# EAGLE board R211 (EAGLE 6.6.0)
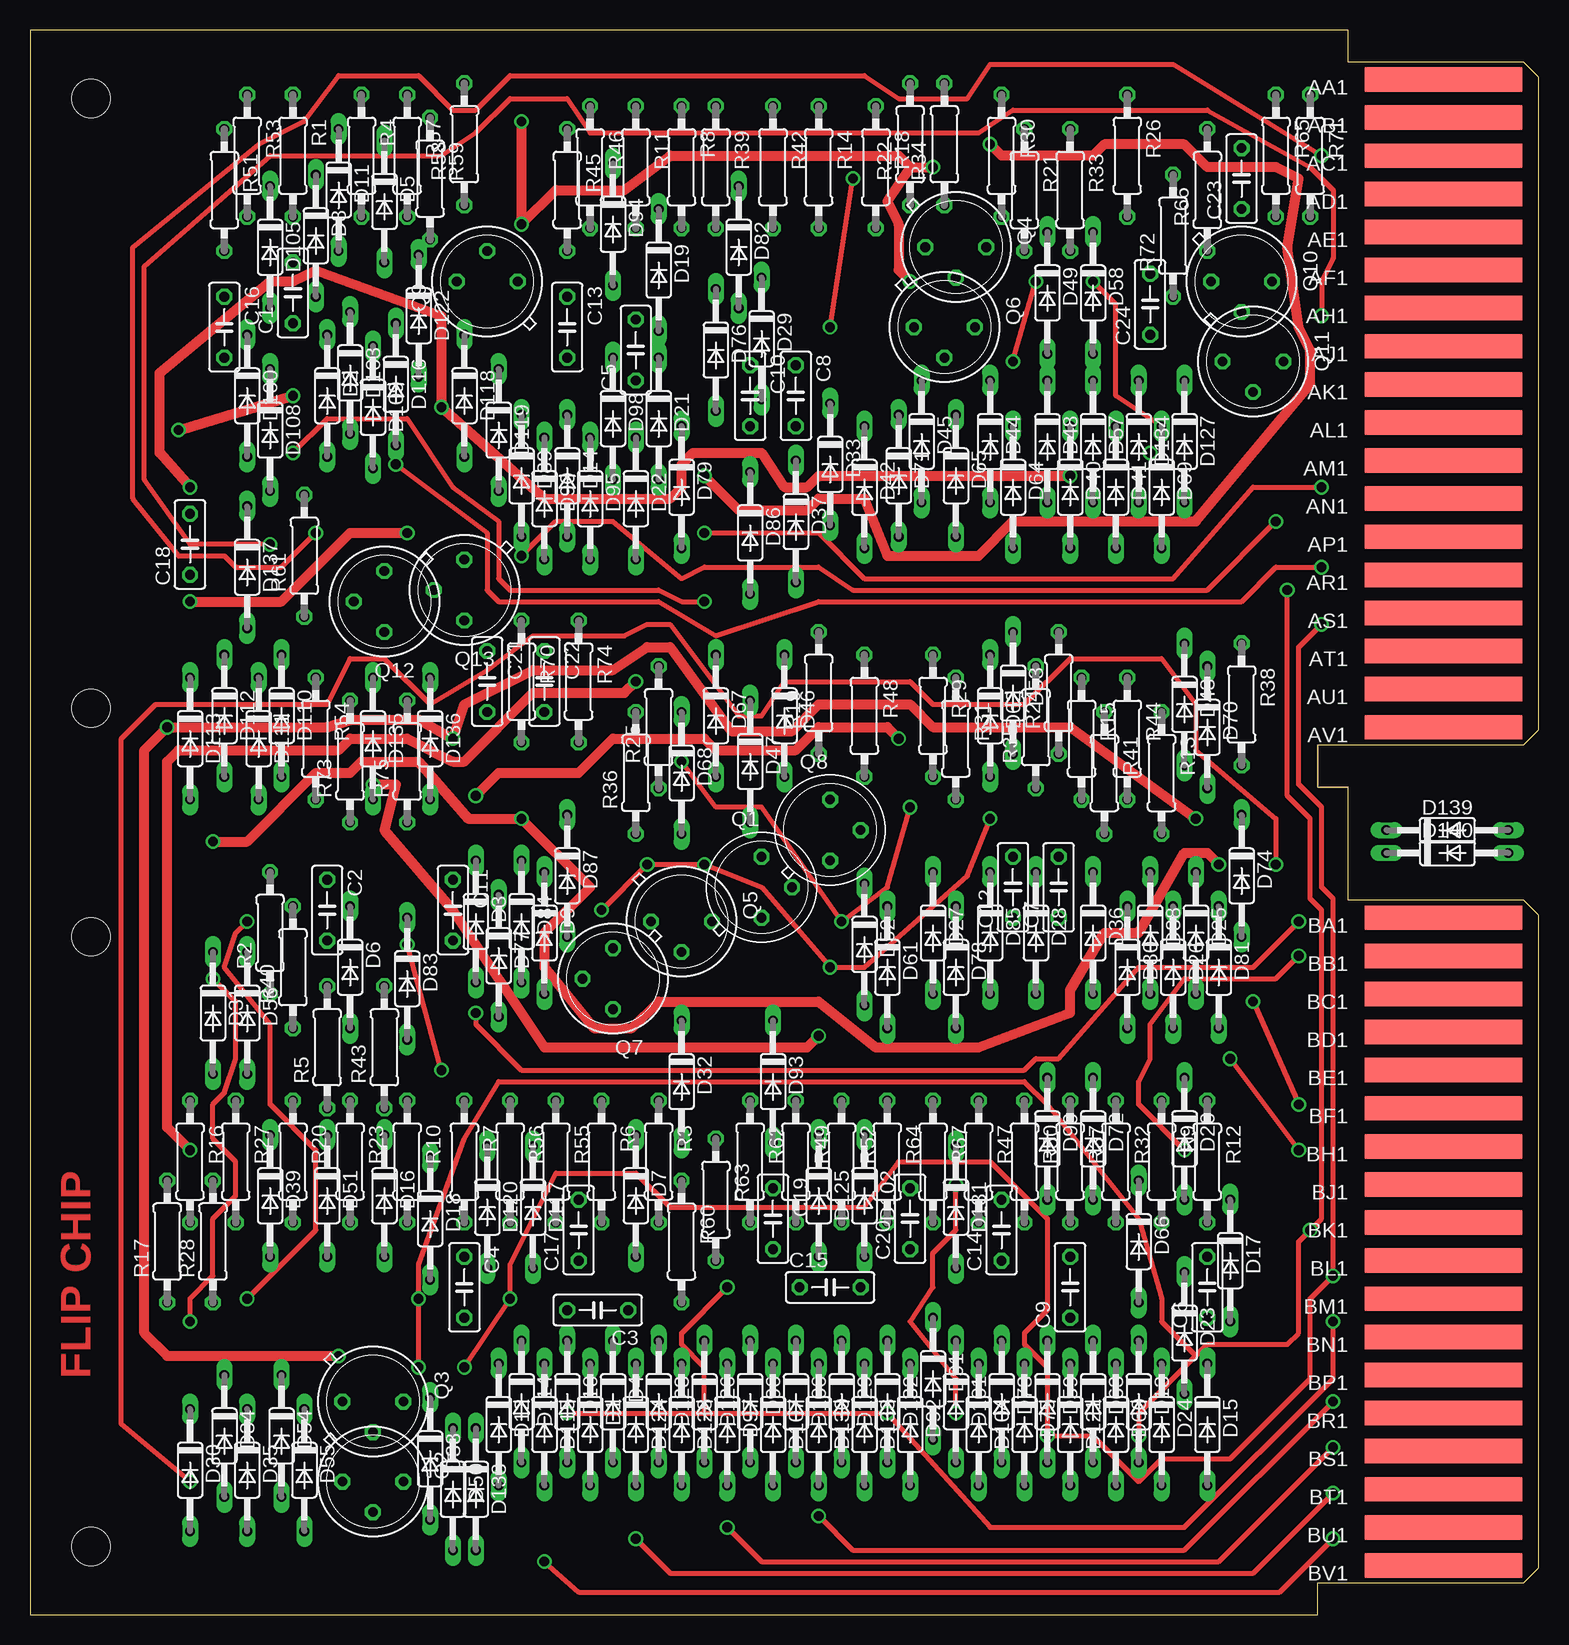
[diagram p1: board, top side]
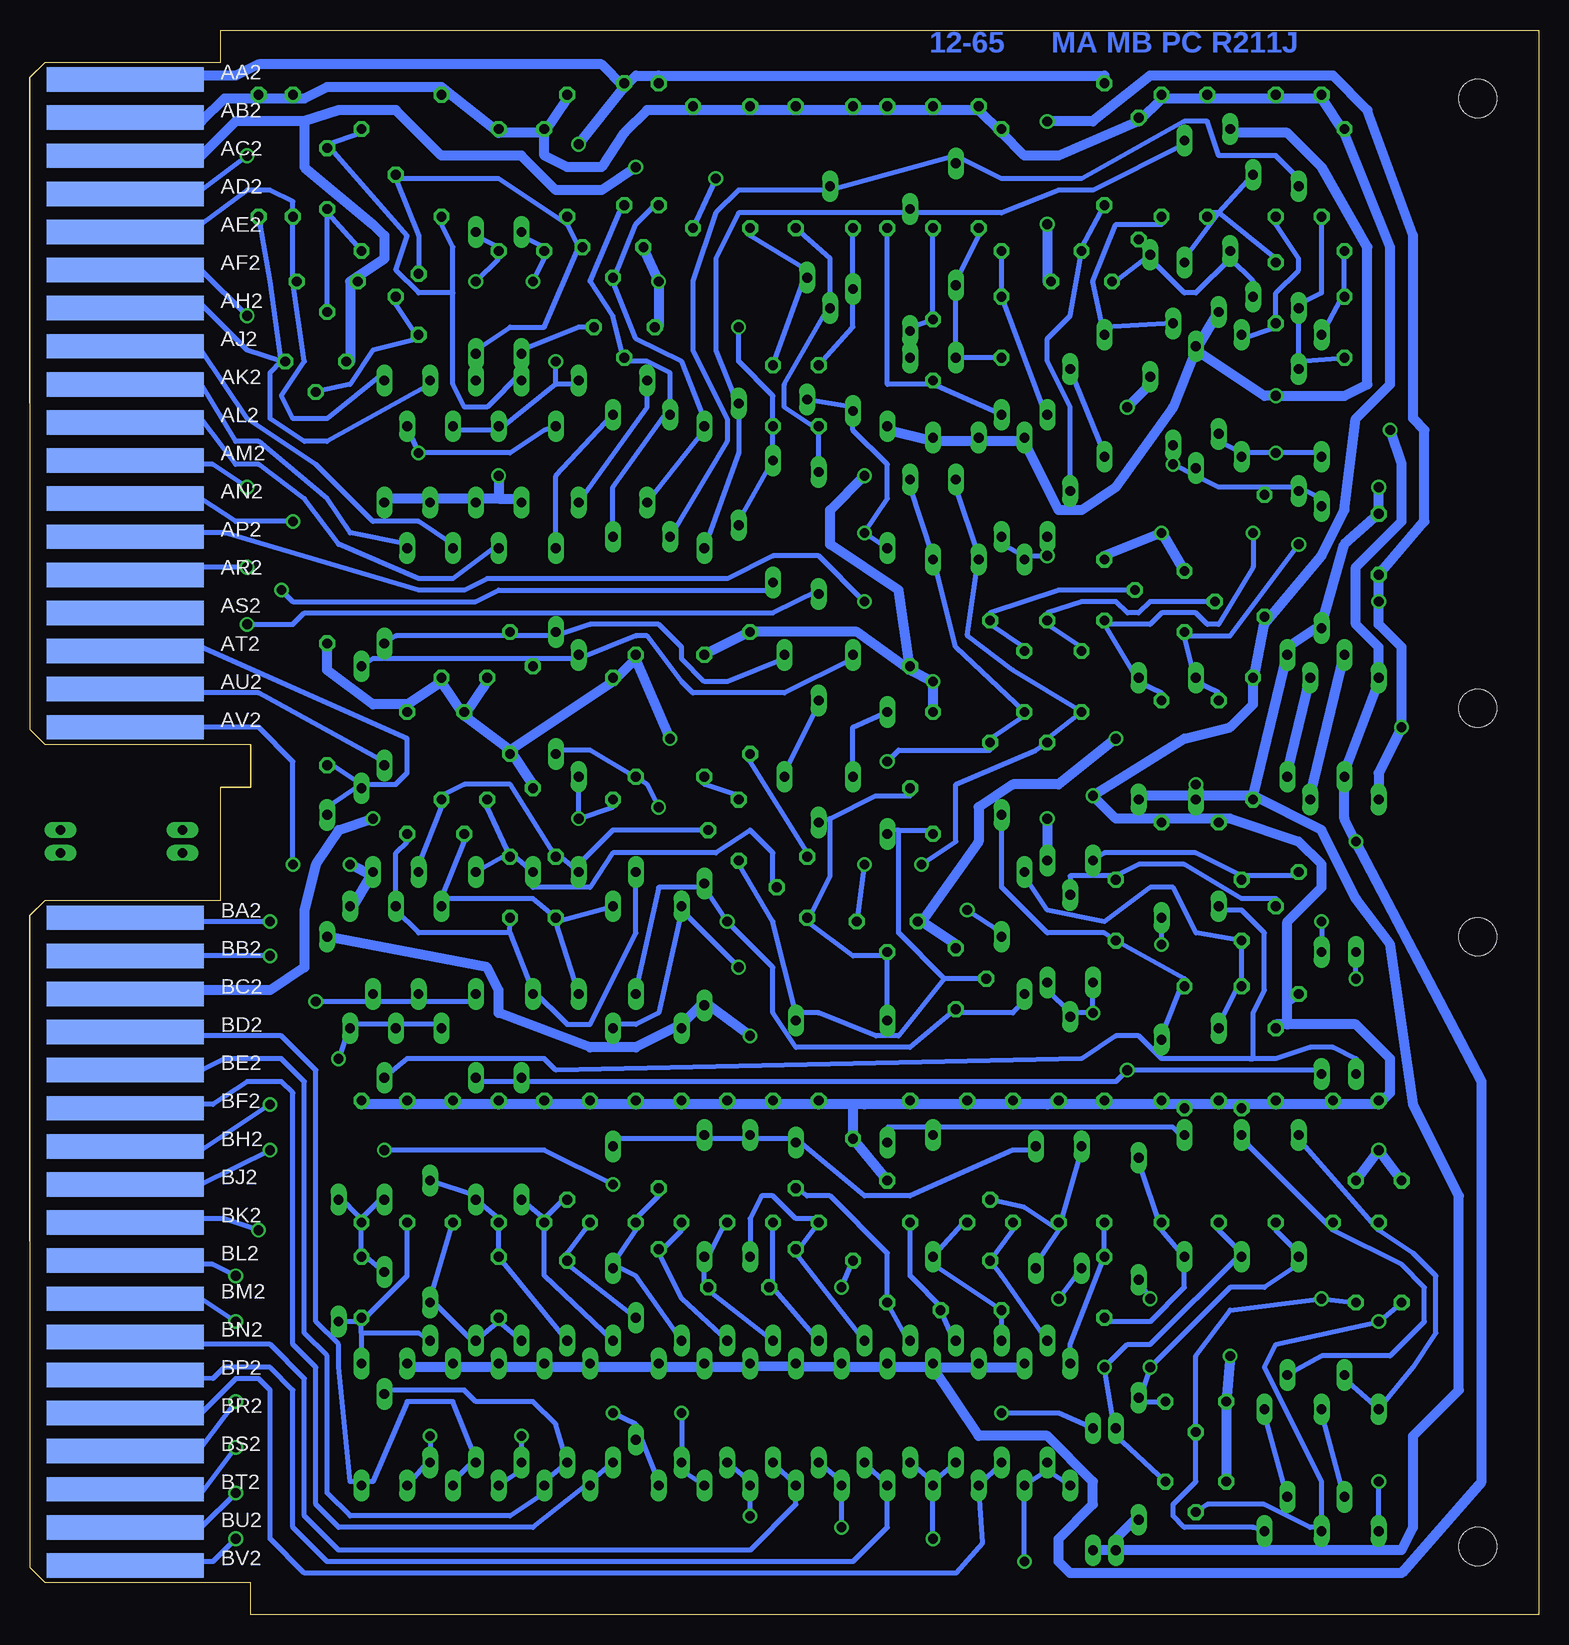
[diagram p2: board, bottom side, seen from below]

Size 125.73 x 132.08 mm. Coordinates in mm from the lower left corner, seen from the top.
Copper layers (1+16): Top 0.035mm / dielectric 1.5mm / Bottom 0.035mm
Design rules "16mils": minimum track width 16mil, minimum drill 32mil, track to track 15mil, track to pad 10mil, pad to pad 10mil, via to via 10mil, smd to smd 10mil, copper to edge 13mil, drill to drill 10mil, minimum pad ring 10mil, minimum via ring 8mil, stop-mask expansion 0mil, vias tented up to drill 0mil, thermal gap 10mil
Net classes: 1 Power: width 0.813 mm

## Footprints (pad centres in the part's own frame; a part is rotated, then mirrored left to right if it is on the bottom)
C050-025X075 = drill 0.813 octagon: 1 -2.54,0; 2 2.54,0
DO35-10 = drill 0.813 long: A 5.08,0; C -5.08,0
TO5 = drill 0.813 octagon: 1 0,-2.54; 2 2.54,0; 3 0,2.54
TO39 = drill 0.813 octagon: 1 0,-2.54; 2 2.54,0; 3 0,2.54
0207/10 = drill 0.813 octagon: 1 -5.08,0; 2 5.08,0
EDGE-CON4 = smd 13.106 x 2.032: AA1 7.938,4.128; AB1 7.938,7.303; AC1 7.938,10.477; AD1 7.938,13.652; AE1 7.938,16.828; AF1 7.938,20.003; AH1 7.938,23.177; AJ1 7.938,26.352; AK1 7.938,29.527; AL1 7.938,32.703; AM1 7.938,35.877; AN1 7.938,39.053; AP1 7.938,42.227; AR1 7.938,45.403; AS1 7.938,48.578; AT1 7.938,51.752; AU1 7.938,54.928; AV1 7.938,58.102; BA1 7.938,73.978; BB1 7.938,77.153; BC1 7.938,80.328; BD1 7.938,83.502; BE1 7.938,86.677; BF1 7.938,89.853; BH1 7.938,93.028; BJ1 7.938,96.203; BK1 7.938,99.377; BL1 7.938,102.552; BM1 7.938,105.728; BN1 7.938,108.903; BP1 7.938,112.078; BR1 7.938,115.252; BS1 7.938,118.427; BT1 7.938,121.603; BU1 7.938,124.778; BV1 7.938,127.953 | smd 13.106 x 2.032 bottom: AA2 7.938,4.128; AB2 7.938,7.303; AC2 7.938,10.477; AD2 7.938,13.652; AE2 7.938,16.828; AF2 7.938,20.003; AH2 7.938,23.177; AJ2 7.938,26.352; AK2 7.938,29.527; AL2 7.938,32.703; AM2 7.938,35.877; AN2 7.938,39.053; AP2 7.938,42.227; AR2 7.938,45.403; AS2 7.938,48.578; AT2 7.938,51.752; AU2 7.938,54.928; AV2 7.938,58.102; BA2 7.938,73.978; BB2 7.938,77.153; BC2 7.938,80.328; BD2 7.938,83.502; BE2 7.938,86.677; BF2 7.938,89.853; BH2 7.938,93.028; BJ2 7.938,96.203; BK2 7.938,99.377; BL2 7.938,102.552; BM2 7.938,105.728; BN2 7.938,108.903; BP2 7.938,112.078; BR2 7.938,115.252; BS2 7.938,118.427; BT2 7.938,121.603; BU2 7.938,124.778; BV2 7.938,127.953
DOUBLE = hole 3.175: 120.65,56.515; 120.65,5.715; 120.65,75.565; 120.65,126.365

## Placement (x,y rotation side)
C1  82pF 5%  [C050-025X075]  21.91,110.17 90 top
C2  82pF 5%  [C050-025X075]  24.77,58.74 270 top
C3  82pF 5%  [C050-025X075]  47.31,25.4 180 top
C4  82pF 5%  [C050-025X075]  36.2,27.31 270 top
C5  82pF 5%  [C050-025X075]  50.48,105.41 90 top
C6  82pF 5%  [C050-025X075]  98.11,27.31 90 top
C7  47pF 5%  [C050-025X075]  85.72,60.64 90 top
C8  82pF 5%  [C050-025X075]  63.82,101.6 270 top
C9  82pF 5%  [C050-025X075]  86.68,27.31 90 top
C10  82pF 5%  [C050-025X075]  60.01,101.6 270 top
C11  82pF 5%  [C050-025X075]  35.24,58.74 270 top
C12  47pF 5%  [C050-025X075]  81.92,60.64 90 top
C13  82pF 5%  [C050-025X075]  44.77,107.32 270 top
C14  82pF 5%  [C050-025X075]  80.96,32.07 90 top
C15  82pF 5%  [C050-025X075]  66.67,27.31 0 top
C16  82pF 5%  [C050-025X075]  16.19,107.32 270 top
C17  82pF 5%  [C050-025X075]  45.72,32.07 90 top
C18  .01uF  [C050-025X075]  13.34,89.22 90 top
C19  82pF 5%  [C050-025X075]  61.91,33.02 270 top
C20  82pF 5%  [C050-025X075]  73.34,33.02 90 top
C21  56pF  [C050-025X075]  38.1,77.79 270 top
C22  56pF  [C050-025X075]  42.86,77.79 270 top
C23  56pF  [C050-025X075]  100.97,119.7 90 top
C24  56pF  [C050-025X075]  93.34,109.22 90 top
D1  [DO35-10]  46.67,15.88 270 top
D2  [DO35-10]  24.77,101.6 270 top
D3  [DO35-10]  37.15,57.79 270 top
D4  [DO35-10]  48.58,17.78 270 top
D5  [DO35-10]  29.53,117.79 270 top
D6  [DO35-10]  26.67,53.98 270 top
D7  [DO35-10]  50.48,34.93 270 top
D8  [DO35-10]  23.81,114.94 270 top
D9  [DO35-10]  42.86,56.83 270 top
D10  [DO35-10]  44.77,17.78 270 top
D11  [DO35-10]  25.72,118.75 270 top
D12  [DO35-10]  39.05,15.88 270 top
D13  [DO35-10]  92.39,17.78 270 top
D14  [DO35-10]  44.77,94.93 270 top
D15  [DO35-10]  98.11,15.88 270 top
D16  [DO35-10]  29.53,34.93 270 top
D17  [DO35-10]  100.01,29.53 270 top
D18  [DO35-10]  33.34,33.02 270 top
D19  [DO35-10]  52.39,112.08 270 top
D20  [DO35-10]  96.2,39.69 270 top
D21  [DO35-10]  52.39,99.7 270 top
D22  [DO35-10]  50.48,93.03 270 top
D23  [DO35-10]  96.2,23.5 270 top
D24  [DO35-10]  94.3,15.88 270 top
D25  [DO35-10]  97.16,56.83 270 top
D26  [DO35-10]  95.25,53.98 270 top
D27  [DO35-10]  75.25,56.83 270 top
D28  [DO35-10]  83.82,56.83 270 top
D29  [DO35-10]  60.96,106.36 270 top
D30  [DO35-10]  13.34,12.07 270 top
D31  [DO35-10]  15.24,50.17 270 top
D32  [DO35-10]  54.29,44.45 270 top
D33  [DO35-10]  66.67,95.89 270 top
D34  1N645  [DO35-10]  16.19,14.92 270 top
D35  1N645  [DO35-10]  18.1,12.07 270 top
D36  [DO35-10]  88.58,56.83 270 top
D37  [DO35-10]  63.82,91.12 270 top
D38  [DO35-10]  33.34,13.02 270 top
D39  [DO35-10]  20,34.93 270 top
D40  [DO35-10]  86.68,93.98 270 top
D41  [DO35-10]  90.49,93.98 270 top
D42  [DO35-10]  69.53,93.98 270 top
D43  [DO35-10]  96.2,75.88 270 top
D44  1N645  [DO35-10]  80.01,97.79 270 top
D45  1N645  [DO35-10]  74.3,97.79 270 top
D46  1N645  [DO35-10]  62.87,74.93 270 top
D47  1N645  [DO35-10]  60.01,71.12 270 top
D48  [DO35-10]  84.77,97.79 270 top
D49  [DO35-10]  84.77,110.17 270 top
D50  [DO35-10]  35.24,10.48 270 top
D51  [DO35-10]  24.77,34.93 270 top
D52  [DO35-10]  69.53,55.88 270 top
D53  [DO35-10]  81.92,76.84 270 top
D54  1N645  [DO35-10]  20.95,14.92 270 top
D55  1N645  [DO35-10]  22.86,12.07 270 top
D56  [DO35-10]  18.1,50.17 270 top
D57  [DO35-10]  88.58,97.79 270 top
D58  [DO35-10]  88.58,110.17 270 top
D59  [DO35-10]  84.77,17.78 270 top
D60  [DO35-10]  90.49,15.88 270 top
D61  [DO35-10]  71.44,53.98 270 top
D62  [DO35-10]  80.01,74.93 270 top
D63  [DO35-10]  88.58,17.78 270 top
D64  1N645  [DO35-10]  81.92,93.98 270 top
D65  1N645  [DO35-10]  77.15,94.93 270 top
D66  [DO35-10]  92.39,31.12 270 top
D67  1N645  [DO35-10]  57.15,74.93 270 top
D68  1N645  [DO35-10]  54.29,70.17 270 top
D69  [DO35-10]  94.3,93.98 270 top
D70  [DO35-10]  98.11,73.98 270 top
D71  [DO35-10]  72.39,94.93 270 top
D72  [DO35-10]  88.58,39.69 270 top
D73  [DO35-10]  80.96,17.78 270 top
D74  [DO35-10]  100.97,61.6 270 top
D75  [DO35-10]  82.87,15.88 270 top
D76  [DO35-10]  57.15,105.41 270 top
D77  [DO35-10]  39.05,54.93 270 top
D78  [DO35-10]  77.15,53.98 270 top
D79  [DO35-10]  54.29,93.98 270 top
D80  [DO35-10]  91.44,53.98 270 top
D81  [DO35-10]  99.06,53.98 270 top
D82  [DO35-10]  59.05,113.98 270 top
D83  [DO35-10]  31.43,53.02 270 top
D84  [DO35-10]  40.96,57.79 270 top
D85  [DO35-10]  80.01,56.83 270 top
D86  [DO35-10]  60.01,90.17 270 top
D87  [DO35-10]  44.77,61.6 270 top
D88  [DO35-10]  93.34,56.83 270 top
D89  [DO35-10]  40.96,94.93 270 top
D90  [DO35-10]  42.86,93.03 270 top
D91  [DO35-10]  75.25,19.69 270 top
D92  [DO35-10]  73.34,15.88 270 top
D93  [DO35-10]  61.91,44.45 270 top
D94  [DO35-10]  48.58,115.89 270 top
D95  [DO35-10]  46.67,93.03 270 top
D96  [DO35-10]  60.01,17.78 270 top
D97  [DO35-10]  58.1,15.88 270 top
D98  [DO35-10]  48.58,99.7 270 top
D99  [DO35-10]  84.77,39.69 270 top
D100  [DO35-10]  18.1,101.6 270 top
D101  [DO35-10]  77.15,17.78 270 top
D102  [DO35-10]  69.53,34.93 270 top
D103  [DO35-10]  26.67,103.51 270 top
D104  [DO35-10]  79.06,15.88 270 top
D105  [DO35-10]  20,113.98 270 top
D106  [DO35-10]  63.82,17.78 270 top
D107  [DO35-10]  61.91,15.88 270 top
D108  [DO35-10]  20,98.74 270 top
D109  [DO35-10]  28.57,100.65 270 top
D110  1N645  [DO35-10]  20.95,74.93 270 top
D111  1N645  [DO35-10]  19.05,73.03 270 top
D112  1N645  [DO35-10]  16.19,74.93 270 top
D113  1N645  [DO35-10]  13.34,73.03 270 top
D114  [DO35-10]  40.96,17.78 270 top
D115  [DO35-10]  42.86,15.88 270 top
D116  [DO35-10]  30.48,102.55 270 top
D117  [DO35-10]  41.91,33.97 270 top
D118  1N645  [DO35-10]  36.2,101.6 270 top
D119  1N645  [DO35-10]  39.05,98.74 270 top
D120  [DO35-10]  38.1,33.97 270 top
D121  [DO35-10]  86.68,15.88 270 top
D122  [DO35-10]  32.38,108.27 270 top
D123  [DO35-10]  52.39,17.78 270 top
D124  [DO35-10]  50.48,15.88 270 top
D125  [DO35-10]  65.72,34.93 270 top
D126  [DO35-10]  56.2,17.78 270 top
D127  [DO35-10]  96.2,97.79 270 top
D128  [DO35-10]  54.29,15.88 270 top
D129  [DO35-10]  67.63,17.78 270 top
D130  [DO35-10]  65.72,15.88 270 top
D131  [DO35-10]  77.15,33.97 270 top
D132  [DO35-10]  71.44,17.78 270 top
D133  [DO35-10]  69.53,15.88 270 top
D134  [DO35-10]  92.39,97.79 270 top
D135  [DO35-10]  28.57,73.03 270 top
D136  [DO35-10]  33.34,73.03 270 top
D137  [DO35-10]  18.1,87.31 270 top
D138  [DO35-10]  37.15,10.48 270 top
D139  [DO35-10]  118.11,65.41 0 top
D140  [DO35-10]  118.11,63.5 0 top
Q1  2N3009  [TO5]  60.96,60.64 0 top
Q2  2N3639  [TO39]  28.57,11.11 270 top
Q3  2N3639  [TO39]  28.57,17.78 270 top
Q4  2N3639  [TO39]  77.15,113.98 270 top
Q5  2N3639  [TO39]  54.29,57.79 270 top
Q6  2N3639  [TO39]  76.2,107.32 270 top
Q7  2N3639  [TO39]  48.58,53.02 180 top
Q8  2N3009  [TO5]  66.67,65.41 0 top
Q9  2N3639  [TO39]  38.1,111.13 90 top
Q10  2N3639  [TO39]  100.97,111.13 270 top
Q11  2N3639  [TO39]  101.92,104.46 270 top
Q12  2N3639  [TO39]  29.53,84.46 180 top
Q13  2N3639  [TO39]  36.2,85.41 180 top
R1  [0207/10]  21.91,121.6 270 top
R2  [0207/10]  20,56.83 90 top
R3  [0207/10]  52.39,37.78 270 top
R4  [0207/10]  27.62,121.6 270 top
R5  [0207/10]  24.77,47.31 90 top
R6  [0207/10]  47.62,37.78 270 top
R7  [0207/10]  36.2,37.78 270 top
R8  [0207/10]  54.29,120.65 270 top
R9  [0207/10]  94.3,37.78 270 top
R10  [0207/10]  31.43,37.78 270 top
R11  [0207/10]  50.48,120.65 270 top
R12  [0207/10]  98.11,37.78 270 top
R13  10K  [0207/10]  94.3,70.17 270 top
R14  [0207/10]  65.72,120.65 270 top
R15  10K  [0207/10]  87.63,73.03 270 top
R16  [0207/10]  13.34,37.78 270 top
R17  100K  [0207/10]  11.43,31.12 90 top
R18  [0207/10]  70.48,120.65 270 top
R19  1500 1/4W  [0207/10]  65.72,76.84 90 top
R20  3K 1/4W  [0207/10]  21.91,37.78 270 top
R21  [0207/10]  82.87,118.75 270 top
R22  100K  [0207/10]  73.34,122.56 90 top
R23  3K 1/4W  [0207/10]  26.67,37.78 270 top
R24  [0207/10]  85.72,76.84 90 top
R25  100K  [0207/10]  52.39,73.98 90 top
R26  3K 1/4W  [0207/10]  91.44,121.6 270 top
R27  [0207/10]  17.14,37.78 270 top
R28  100K  [0207/10]  15.24,31.12 90 top
R29  1500 1/4W  [0207/10]  75.25,74.93 270 top
R30  3K 1/4W  [0207/10]  80.96,121.6 270 top
R31  1500 1/4W  [0207/10]  77.15,73.03 270 top
R32  [0207/10]  90.49,37.78 270 top
R33  [0207/10]  86.68,118.75 270 top
R34  100K  [0207/10]  76.2,122.56 90 top
R35  [0207/10]  83.82,73.98 90 top
R36  100K  [0207/10]  50.48,70.17 90 top
R37  [0207/10]  86.68,37.78 270 top
R38  750 1/4W  [0207/10]  100.97,75.88 270 top
R39  [0207/10]  57.15,120.65 270 top
R40  [0207/10]  21.91,53.98 90 top
R41  10K  [0207/10]  89.53,70.17 270 top
R42  [0207/10]  61.91,120.65 270 top
R43  [0207/10]  29.53,47.31 90 top
R44  10K  [0207/10]  91.44,73.03 270 top
R45  [0207/10]  44.77,118.75 270 top
R46  [0207/10]  46.67,120.65 270 top
R47  [0207/10]  79.06,37.78 270 top
R48  1500 1/4W  [0207/10]  69.53,74.93 270 top
R49  [0207/10]  63.82,37.78 270 top
R50  [0207/10]  82.87,37.78 270 top
R51  [0207/10]  16.19,118.75 270 top
R52  [0207/10]  67.63,37.78 270 top
R53  [0207/10]  18.1,121.6 270 top
R54  1500  [0207/10]  23.81,73.03 270 top
R55  [0207/10]  43.81,37.78 270 top
R56  [0207/10]  40.01,37.78 270 top
R57  [0207/10]  31.43,121.6 270 top
R58  100K  [0207/10]  36.2,122.56 90 top
R59  3K 1/4W  [0207/10]  33.34,119.7 270 top
R60  [0207/10]  54.29,31.12 270 top
R61  1500 1/4W  [0207/10]  22.86,88.27 90 top
R62  [0207/10]  60.01,37.78 270 top
R63  1.5K 1/4W  [0207/10]  57.15,34.61 270 top
R64  [0207/10]  71.44,37.78 270 top
R65  1500 1/4W  [0207/10]  103.82,121.6 270 top
R66  1500 1/4W  [0207/10]  98.11,118.75 90 top
R67  [0207/10]  75.25,37.78 270 top
R70  1500 1/4W  [0207/10]  40.96,77.79 270 top
R71  1500 1/4W  [0207/10]  106.68,121.6 270 top
R72  1500 1/4W  [0207/10]  95.25,114.94 90 top
R73  3K 1/4W  [0207/10]  26.67,71.12 90 top
R74  1500 1/4W  [0207/10]  45.72,77.79 270 top
R75  3K 1/4W  [0207/10]  31.43,71.12 90 top
U$1  [EDGE-CON4]  125.73,132.08 180 top
U$2  FLIPCHIP  [FLIPCHIP]  0,0.64 0 top
U$3  OUTLINE-DOUBLE  [DOUBLE]  125.73,132.08 180 top

## Tracks (layer width: path | path; a pad name or v marks a point on that pad's centre or on a via)
+10V  (via drill 0.81)
  Top 0.813: v80.01,122.56 80.96,121.6 88.58,121.6 89.53,122.56 96.2,122.56 98.11,120.65 103.82,120.65 105.73,119.7 104.78,113.98 105.73,107.32 106.68,105.41 106.68,102.55 97.16,91.12 81.92,91.12 79.06,88.27 71.44,88.27 69.53,93.03 65.72,93.03 64.77,92.08 59.05,92.08 v56.2,94.93 | v13.34,38.74 11.43,40.64 11.43,71.12 12.38,72.07 25.72,72.07 26.67,73.03 31.43,73.03 35.24,71.12 36.2,71.12 41.91,76.84 49.53,76.84 v50.48,77.79
  Bottom 0.813: U$1.AA2 116.2,128.27 108.58,128.27 106.68,129.22 78.11,129.22 76.2,127.32 | v80.01,122.56 76.2,127.32 | 76.2,127.32 75.25,128.27 73.34,128.27 | 73.34,128.27 36.2,128.27 R58.2 | R28.2 v13.34,38.74 R17.2 | R48.1 R19.2 56.83,81.92 52.39,78.74 | 52.39,78.74 v50.48,77.79 R36.2 | 52.39,78.74 53.34,85.41 59.05,89.22 59.05,92.08 v56.2,94.93 | 73.34,128.27 R22.2 | 76.2,127.32 R34.2 | 52.39,78.74 R25.2
-0.7V  (via drill 0.81)
  Top 0.813: v99.06,62.55 98.11,63.5 96.2,63.5 92.39,56.83 89.53,56.83 86.68,52.07 86.68,50.17 79.06,47.31 70.48,47.31 65.72,51.12 52.39,51.12 50.16,48.9 46.99,48.9 42.86,53.98 42.86,56.83 46.67,60.64 v40.96,66.36 36.51,66.36 32.38,71.12 27.62,71.12 26.67,70.17 23.81,70.17 18.1,64.45 v15.24,64.45 | v12.38,98.74 v21.91,101.6
  Bottom 0.813: D115.C 42.86,20.64 46.67,20.64 | 50.48,20.64 46.67,20.64 | 50.48,20.64 54.29,20.64 | 54.29,20.64 58.1,20.64 | 58.1,20.64 61.91,20.69 | 61.91,20.69 65.72,20.74 65.72,20.64 | 65.72,20.64 69.53,20.64 | 69.53,20.64 73.34,20.64 | 73.34,20.64 79.06,20.64 | 79.06,20.64 82.87,20.64 | 46.67,20.64 D1.C | 50.48,20.64 D124.C | 54.29,20.64 D128.C | 58.1,20.64 D97.C | 61.91,20.69 61.91,20.64 D107.C | 65.72,20.64 D130.C | 79.06,20.64 79.05,20.91 | 79.06,20.64 D104.C | 50.48,20.64 46.67,14.92 40.96,14.92 37.15,11.11 37.15,9.21 40.01,6.35 40.01,4.45 39.05,3.49 11.43,3.49 4.76,11.11 4.76,44.45 v15.24,64.45 16.19,66.36 D112.A 16.19,70.17 13.34,77.79 D113.C 13.34,80.65 15.24,82.55 15.24,87.31 11.43,91.12 11.43,95.89 v12.38,98.74 | D81.C 99.06,58.74 D25.C 97.16,61.6 v99.06,62.55 | 82.87,20.64 D75.C | 82.87,20.64 86.68,20.64 | 86.68,20.64 90.49,20.64 | 90.49,20.64 94.3,20.64 D24.C | 90.49,20.64 D60.C | 86.68,20.64 D121.C | 69.53,20.64 D133.C | v40.96,66.36 D84.C | 28.57,105.41 22.86,101.6 v21.91,101.6 16.19,101.6 14.29,102.55 14.29,113.98 18.1,120.65 20.95,123.51 25.72,123.51 D11.C | 28.57,105.41 30.48,100.65 35.24,93.98 38.1,92.08 40.01,92.08 42.86,97.79 | 42.86,97.79 46.67,97.79 | 46.67,97.79 50.48,97.79 | 50.48,97.79 54.29,98.74 D79.C | 42.86,97.79 D90.C | 46.67,97.79 D95.C | 28.57,105.41 D103.C | 28.57,105.41 D109.C | 73.34,20.64 D92.C | 50.48,97.79 D22.C
-3V  (via drill 0.81)
  Top 0.813: v65.72,48.26 64.77,47.31 42.86,47.31 35.24,58.74 29.53,65.41 30.48,69.22 v28.57,69.22 | v13.34,93.98 10.79,96.84 10.79,103.51 20,111.13 21.91,111.13 23.81,112.08 34.29,108.27 v34.29,100.65 42.86,93.03 53.34,93.03 54.29,93.98 54.29,95.89 55.24,96.84 60.96,96.84 62.87,93.98 64.77,93.98 65.72,94.93 v86.68,94.93
  Bottom 0.813: 23.81,68.26 D110.C 20.95,80.65 18.1,82.55 | D74.A 87.63,53.98 86.68,52.07 86.68,50.17 79.06,47.31 75.25,47.31 71.44,49.21 | 69.53,51.12 71.44,49.21 | v65.72,48.26 69.53,51.12 | D50.A D138.A | D50.A 11.43,5.4 10.48,7.3 10.48,14.92 6.67,18.73 6.67,34.93 10.48,42.55 12.38,55.88 15.24,59.69 18.1,65.41 23.81,68.26 | D50.A 35.24,6.35 33.34,8.26 D38.A | 92.39,93.03 96.2,93.03 D127.A | 86.68,93.03 84.77,93.03 D48.A | 86.68,93.03 88.58,93.03 | 88.58,93.03 92.39,93.03 | 92.39,93.03 D134.A | v86.68,94.93 86.68,93.03 | 23.81,68.26 R54.2 | 88.58,93.03 D57.A | 18.1,82.55 16.19,89.22 C18.2 v13.34,93.98 | 23.81,68.26 28.57,68.26 | 28.57,68.26 33.34,68.26 D136.A | 28.57,68.26 v28.57,69.22 | 18.1,82.55 D137.A | 28.57,68.26 D135.A | 69.53,51.12 D52.A | 71.44,49.21 D61.A | D122.A 32.38,102.55 v34.29,100.65
-15V  (via drill 0.81)
  Top 0.813: v72.39,73.03 71.44,73.98 65.72,73.98 63.82,72.07 57.15,72.07 56.2,73.03 48.58,73.03 45.72,70.17 39.05,70.17 v37.15,68.26
  Bottom 0.813: 94.3,42.55 98.11,42.55 R12.1 | 86.68,42.55 90.49,42.55 | 90.49,42.55 94.3,42.55 | 82.87,42.55 86.68,42.55 | 86.68,42.55 R37.1 | 47.62,42.55 52.39,42.55 | 52.39,42.55 56.2,42.55 | 56.2,42.55 60.01,42.55 | 60.01,42.55 63.82,42.55 | 63.82,42.55 67.63,42.55 | 67.63,42.55 71.44,42.55 | 71.44,42.55 75.25,42.55 | 75.25,42.55 79.06,42.55 | 79.06,42.55 82.87,42.55 | 82.87,42.55 R50.1 | 52.39,42.55 R3.1 | 56.2,42.55 57.15,42.55 R63.1 R60.1 | 60.01,42.55 R62.1 | 63.82,42.55 R49.1 | 67.63,42.55 R52.1 | 71.44,42.55 R64.1 | U$1.AB2 117.16,124.46 111.44,124.46 109.54,126.37 106.68,126.37 | 103.82,126.37 102.87,126.37 100.97,127.32 91.44,127.32 | 103.82,126.37 106.68,126.37 | 86.68,123.51 91.44,127.32 | 82.87,123.51 86.68,123.51 | 82.87,123.51 80.96,126.37 R30.1 | 82.87,123.51 82.87,121.6 80.96,120.65 78.11,120.65 76.2,123.51 74.3,125.41 70.48,125.41 | 46.67,125.41 50.48,125.41 | 50.48,125.41 54.29,125.41 | 54.29,125.41 57.15,125.41 | 57.15,125.41 61.91,125.41 | 61.91,125.41 65.72,125.41 | 65.72,125.41 70.48,125.41 | 44.77,123.51 42.86,121.6 40.01,121.6 33.34,124.46 | 44.77,123.51 46.67,125.41 | 31.43,126.37 33.34,124.46 | 18.1,126.37 21.91,126.37 | 21.91,126.37 27.62,126.37 | 27.62,126.37 31.43,126.37 | 16.19,123.51 18.1,126.37 | 16.19,123.51 12.38,113.98 12.38,102.55 15.24,99.7 16.19,92.08 18.1,88.27 22.86,82.55 | 22.86,82.55 23.81,77.79 R54.1 23.81,75.88 25.72,73.98 29.53,73.03 v37.15,68.26 35.24,66.36 31.43,66.36 | 26.67,66.36 25.72,66.36 20,64.45 18.1,62.55 18.1,60.64 20.95,57.79 20.95,51.12 | 26.67,66.36 31.43,66.36 | 47.62,42.55 R6.1 | 13.34,42.55 17.14,42.55 | 17.14,42.55 21.91,42.55 | 21.91,42.55 24.77,42.55 | 24.77,42.55 26.67,42.55
  Bottom 0.813: 26.67,42.55 29.53,42.55 | 29.53,42.55 31.43,42.55 | 31.43,42.55 36.2,42.55 | 36.2,42.55 40.96,42.55 | 40.96,42.55 43.81,42.55 | 43.81,42.55 47.62,42.55 | 13.34,42.55 12.38,43.5 12.38,46.36 15.24,49.21 20.95,49.21 | 20.95,49.21 21.91,49.21 R40.1 | 20.95,49.21 20.95,51.12 | R38.1 100.97,78.74 97.16,75.88 94.3,75.88 | 91.44,77.79 94.3,75.88 | 89.53,74.93 91.44,77.79 | 89.53,74.93 87.63,77.79 R15.1 | 85.72,72.07 89.53,74.93 | 85.72,72.07 83.82,69.22 R35.1 | 77.15,77.79 85.72,72.07 | 75.25,79.69 77.15,77.79 | v72.39,73.03 75.25,79.69 | 75.25,42.55 R67.1 | 94.3,42.55 R9.1 | 21.91,42.55 R20.1 | 26.67,42.55 R23.1 | 106.68,126.37 R71.1 | 103.82,126.37 R65.1 | 31.43,42.55 R10.1 | 36.2,42.55 R7.1 | 43.81,42.55 R55.1 | 40.96,42.55 R56.1 | 90.49,42.55 R32.1 | 79.06,42.55 R47.1 | 13.34,42.55 R16.1 | 17.14,42.55 R27.1 | 91.44,127.32 R26.1 | 82.87,123.51 R21.1 | 86.68,123.51 R33.1 | 85.72,72.07 R24.1 | 31.43,126.37 R57.1 | 27.62,126.37 R4.1 | 21.91,126.37 R1.1 | 26.67,66.36 R73.1 | 31.43,66.36 R75.1 | 24.77,42.55 R5.1 | 20.95,51.12 R2.1 | 29.53,42.55 R43.1 | 91.44,77.79 R44.1 | 94.3,75.88 R13.1 | 89.53,74.93 R41.1 | 57.15,125.41 R39.1 | 61.91,125.41 R42.1 | 65.72,125.41 R14.1 | 70.48,125.41 R18.1 | 50.48,125.41 R11.1 | 54.29,125.41 R8.1 | 44.77,123.51 R45.1 | 16.19,123.51 R51.1 | 18.1,126.37 R53.1 | 22.86,82.55 R61.1 | 46.67,125.41 R46.1 | 33.34,124.46 R59.1 | 75.25,79.69 R29.1 | 77.15,77.79 R31.1
AC
  Bottom 0.406: U$1.BN2 115.57,23.5 112.39,23.5 111.44,22.54 105.73,22.54 102.87,19.69 102.87,8.26 100.01,5.4 65.72,5.4 61.91,9.21 D107.A D106.A
AC2MB  (via drill 0.81)
  Top 0.406: v108.58,13.97 99.06,4.45 60.96,4.45 v58.1,7.3
  Bottom 0.406: U$1.BT2 117.16,10.16 111.44,10.16 v108.58,13.97 | D96.A 58.1,11.11 D97.A v58.1,7.3
CLEAR_MA
  Bottom 0.406: U$1.AJ2 117.16,105.41 111.44,105.41 107.63,99.7 101.92,95.89 97.16,91.12 93.34,91.12 90.49,89.22 D41.A
CLEAR_MA2
  Bottom 0.406: U$1.AL2 117.16,99.7 111.44,99.7 108.58,95.89 106.68,95.89 102.87,93.03 100.01,89.22 93.34,86.36 90.49,86.36 86.68,89.22 D40.A
CLEAR_MB
  Bottom 0.406: U$1.AU2 117.16,76.84 106.68,76.84 96.2,71.12 D43.A
CLEAR_PC  (via drill 0.81)
  Top 0.406: v103.82,62.55 103.82,66.36 97.16,72.07 97.16,75.88 94.3,79.69 86.68,79.69 82.87,75.88 75.25,75.88 73.34,77.79 62.87,77.79 60.96,74.93 59.05,74.93 53.34,82.55 51.44,82.55 49.53,81.6 41.91,81.6 38.1,78.74 33.34,75.88 29.53,79.69 26.67,79.69 24.77,75.88 10.48,75.88 7.62,73.03 7.62,15.88 v13.34,11.11
  Bottom 0.406: U$1.AV2 117.16,73.98 106.68,73.98 103.82,71.12 v103.82,62.55 | D30.A v13.34,11.11
COMP_PC_PULSE
  Bottom 0.406: U$1.BD2 117.16,48.26 104.78,48.26 101.92,45.4 101.92,24.45 100.01,22.54 100.01,20.64 99.06,11.11 98.11,11.11 | 98.11,11.11 97.16,11.11 94.3,17.78 90.49,17.78 88.58,13.02 | 88.58,13.02 90.49,11.11 D60.A | 98.11,11.11 D15.A | D63.A 88.58,13.02
COUNT_MB  (via drill 0.81)
  Top 0.406: v100.01,46.36 v105.73,38.74
  Bottom 0.406: U$1.BJ2 117.16,35.88 111.44,35.88 v105.73,38.74 | 99.06,49.21 v100.01,46.36 | 95.25,49.21 91.44,49.21 D80.A | 95.25,49.21 99.06,49.21 | 99.06,49.21 D81.A | 95.25,49.21 D26.A
CPC_LVL
  Bottom 0.406: U$1.BE2 111.44,45.4 109.54,46.36 104.78,46.36 102.87,44.45 102.87,23.5 100.97,21.59 100.97,10.16 99.06,8.26 85.72,8.26 82.87,10.16 D75.A 82.87,11.11 D73.A 81.92,15.88 83.82,17.78 88.58,17.78 89.53,18.73 96.2,18.73 D23.A
DADDR2MA  (via drill 0.81)
  Top 0.406: v56.2,84.46 54.29,84.46 52.39,85.41 40.01,85.41 39.05,86.36 39.05,91.12 35.24,93.98 31.43,99.7 24.77,99.7 v21.91,96.84
  Bottom 0.406: U$1.AP2 117.16,90.17 109.54,90.17 93.34,85.41 89.53,85.41 87.63,86.36 67.63,86.36 63.82,88.27 60.01,88.27 v56.2,84.46 | 24.77,96.84 26.67,97.79 D103.A | 24.77,96.84 v21.91,96.84 18.1,96.84 D100.A | 24.77,96.84 D2.A
DATA  (via drill 0.81)
  Top 0.406: v108.58,24.45 108.58,19.69 96.2,7.3 80.01,7.3 v71.44,16.83 56.2,16.83 | v44.77,16.83 56.2,16.83 | 56.2,16.83 56.2,20.64 54.29,22.54 54.29,23.5 v58.1,27.31
  Bottom 0.406: U$1.BM2 111.44,26.35 v108.58,24.45 | D133.A 71.44,12.07 D132.A | D132.A 71.44,13.02 | v71.44,16.83 D132.A | v44.77,16.83 40.01,16.83 D138.C | v58.1,27.31 R63.2
DATA2MB  (via drill 0.81)
  Top 0.406: v108.58,17.78 96.2,5.4 68.58,5.4 v65.72,8.26
  Bottom 0.406: U$1.BS2 116.2,13.97 111.44,13.97 v108.58,17.78 | D129.A 65.72,11.11 D130.A v65.72,8.26
GND  (via drill 0.81)
  Top 0.813: 73.34,120.65 v75.25,120.65 | 73.34,120.65 71.44,117.79 72.39,115.89 72.39,112.08 v73.34,111.13 | v25.72,21.59 11.43,21.59 9.53,23.5 9.53,72.07 v11.43,73.98 24.77,73.98 26.67,74.61 32.38,74.61 v35.24,73.03 36.2,75.88 41.91,78.74 48.58,78.74 51.44,80.65 53.34,80.65 58.42,73.66 63.5,73.66 65.72,75.88 73.34,75.88 75.25,73.98 86.68,73.98 v97.16,66.36 | v40.96,124.46 v40.96,115.89 43.81,118.75 49.53,118.75 53.34,121.6 72.39,121.6 73.34,120.65 | v13.34,84.46 20.95,84.46 26.67,90.17 v31.43,90.17
  Bottom 0.813: U$1.BC2 116.2,52.07 105.73,52.07 102.87,53.98 102.87,58.74 101.92,62.55 100.01,65.41 v97.16,66.36 | U$1.AC2 111.44,121.6 108.58,124.46 102.87,124.46 | 102.87,124.46 102.87,120.65 97.16,115.89 96.2,114.94 96.2,113.03 99.06,111.13 | 99.06,111.13 99.06,104.46 Q11.1 | 102.87,124.46 100.01,125.41 95.25,125.41 91.44,121.6 84.77,121.6 81.92,118.75 78.11,118.75 v75.25,120.65 | Q2.1 Q3.1 v25.72,21.59 | 99.06,111.13 Q10.1 | Q4.1 v73.34,111.13 73.34,107.32 Q6.1 | D113.A 13.34,70.17 v11.43,73.98 11.43,80.65 13.34,82.55 v13.34,84.46 C18.1 9.53,91.12 9.53,98.74 10.48,99.7 10.48,114.94 14.29,125.41 17.14,128.27 32.38,128.27 37.15,124.46 v40.96,124.46 | v35.24,73.03 40.01,69.22 43.81,69.22 46.67,67.31 46.67,64.45 51.44,57.79 | 51.44,57.79 48.58,55.88 Q7.1 | 51.44,57.79 Q5.1 | v40.96,115.89 40.96,111.13 Q9.1 | Q12.1 v31.43,90.17 36.2,88.27 Q13.1
MA=0
  Bottom 0.406: C24.2 93.34,114.94 95.25,119.7 | 95.25,119.7 R72.2 | 95.25,119.7 86.68,119.7 80.96,115.89 | 80.01,113.98 Q4.3 | 80.01,113.98 80.96,115.89 | D57.C D58.A 88.58,105.41 85.72,107.32 82.87,107.32 80.01,113.98 | 80.96,116.84 R30.2 80.96,115.89
MA=1
  Bottom 0.406: 100.97,122.56 C23.2 | R66.2 98.11,123.51 100.97,122.56 | 100.97,122.56 94.3,114.94 95.25,112.08 93.34,110.17 90.49,110.17 | 90.49,110.17 90.49,113.98 91.44,115.89 R26.2 91.44,116.84 | 84.77,103.51 D48.C | 84.77,103.51 D49.A 84.77,105.41 80.01,107.32 Q6.3 | 84.77,103.51 87.63,100.65 89.53,100.65 90.49,102.55 90.49,110.17
MAOUT0
  Bottom 0.406: U$1.AE2 117.16,115.89 111.44,115.89 107.63,118.75 105.73,118.75 103.82,117.79 103.82,116.84 R65.2 103.82,111.13 | 103.82,111.13 102.87,104.46 104.78,101.6 103.82,99.7 100.97,99.7 96.2,103.51 D127.C | 103.82,111.13 Q10.3
MAOUT1
  Bottom 0.406: U$1.AH2 117.16,109.22 111.44,109.22 107.63,105.41 104.78,104.46 | 104.78,104.46 105.73,103.51 105.73,99.7 102.87,97.79 100.97,97.79 92.39,102.55 D134.C | 104.78,104.46 Q11.3 | 104.78,104.46 105.73,111.13 106.53,115.91 | 106.53,115.91 106.68,116.84 | 106.53,115.91 106.68,115.89 R71.2
MB2MA  (via drill 0.81)
  Top 0.406: v103.82,91.12 98.11,85.41 68.58,85.41 65.72,87.31 56.2,87.31 54.29,86.36 48.58,91.12 43.81,91.12 v40.96,88.27
  Bottom 0.406: U$1.AN2 116.2,93.03 111.44,93.03 108.58,91.12 v103.82,91.12 | 42.86,88.27 v40.96,88.27 D89.A | 42.86,88.27 44.77,89.22 D14.A | D90.A 42.86,88.27
MB2PC  (via drill 0.81)
  Top 0.406: v105.73,57.79 101.92,53.98 92.39,53.98 85.72,46.36 83.82,46.36 82.87,45.4 40.96,45.4 37.15,49.21 v37.15,50.17
  Bottom 0.406: U$1.BA2 117.16,57.79 v105.73,57.79 | 39.05,50.17 v37.15,50.17 D3.A | 39.05,50.17 40.96,52.07 D84.A | 39.05,50.17 D77.A
MB=0  (via drill 0.81)
  Top 0.406: v47.62,58.74 v51.44,62.55 v56.2,62.55 60.96,60.64 v66.67,53.98 69.53,53.98 78.11,61.6 v80.01,66.36
  Bottom 0.406: v56.2,62.55 Q5.3 | v51.44,62.55 48.58,64.45 48.58,69.22 41.91,72.07 R70.2 40.96,73.03 C21.2 43.81,78.74 47.62,81.6 46.67,88.27 | v47.62,58.74 44.77,56.83 D87.A | D78.A 77.15,49.21 75.25,49.21 73.34,50.17 71.44,58.74 | 71.44,58.74 D61.C | v66.67,53.98 71.44,58.74 | 46.67,88.27 48.58,93.98 D98.A | 46.67,88.27 D95.A | R31.2 77.15,67.31 v80.01,66.36 D62.A
MB=1  (via drill 0.81)
  Top 0.406: v73.34,67.31 71.44,60.64 v67.63,57.79 60.96,67.31 57.15,67.31 v54.29,71.12
  Bottom 0.406: D9.A 42.86,51.12 43.81,50.17 48.58,50.17 Q7.3 52.39,47.31 61.91,47.31 63.82,50.17 63.82,53.98 v67.63,57.79 69.53,60.64 | 69.53,60.64 D52.C | 69.53,60.64 73.34,60.64 75.25,52.07 D27.A | v73.34,67.31 74.3,69.22 75.42,69.89 | 75.42,69.89 79.06,72.07 81.92,72.07 D53.A | v54.29,71.12 53.34,72.07 45.72,72.07 R74.2 45.72,73.03 42.86,74.93 C22.2 48.58,80.65 50.48,88.27 | 50.48,88.27 52.39,93.98 D21.A | 50.48,88.27 D22.A | 75.42,69.89 75.25,70.17 R29.2
MBCARRYENA  (via drill 0.81)
  Top 0.406: v101.92,51.12 v105.73,42.55
  Bottom 0.406: U$1.BH2 116.2,38.74 111.44,38.74 v105.73,42.55 | 93.34,51.12 88.58,51.12 D36.A | 93.34,51.12 97.16,51.12 | 97.16,51.12 v101.92,51.12 | 97.16,51.12 D25.A | 93.34,51.12 D88.A
MBOUT0  (via drill 0.81)
  Top 0.406: v107.63,121.6 95.25,129.22 80.01,129.22 78.11,126.37 72.39,126.37 69.53,128.27 40.01,128.27 37.15,125.41 35.24,125.41 32.38,128.27 25.72,128.27 22.86,124.46 19.05,122.56 8.57,113.98 8.57,93.03 12.38,88.27 16.19,88.27 17.14,87.31 20.95,87.31 v23.81,90.17
  Bottom 0.406: U$1.AD2 116.2,118.75 111.44,118.75 v107.63,121.6 | v23.81,90.17 23.81,87.31 26.67,82.55 27.62,82.55 28.57,83.5 31.43,83.5 32.38,82.55 36.2,82.55 | 36.2,82.55 33.34,77.79 | 33.34,77.79 31.43,76.84 R75.2 | 33.34,77.79 D136.C | 36.2,82.55 Q13.3
MBOUT1  (via drill 0.81)
  Top 0.406: v107.63,108.27 107.63,111.13 108.58,113.03 108.58,118.75 106.68,120.65 98.11,125.41 81.92,125.41 79.06,123.51 46.67,123.51 44.77,126.37 40.01,126.37 37.15,123.51 34.29,121.6 20,121.6 9.53,112.4 9.53,94.62 13.34,89.22 v20,89.22
  Bottom 0.406: U$1.AF2 116.2,112.08 111.44,112.08 v107.63,108.27 | v20,89.22 25.72,81.6 29.53,81.6 | 28.57,77.79 29.53,81.6 | 28.57,77.79 26.67,76.84 R73.2 | 28.57,77.79 D135.C | 29.53,81.6 Q12.3
N$1
  Bottom 0.406: 50.48,39.69 D7.C 50.48,40.64 | 50.48,40.64 30.48,40.64 29.53,39.69 D16.C | 50.48,40.64 54.29,40.64 D32.A
N$2
  Bottom 0.406: 24.77,53.02 C2.2 28.57,56.83 30.48,60.64 32.38,60.64 36.2,57.79 40.96,58.74 42.86,61.6 D9.C | D6.A 26.67,49.21 24.77,53.02 | 24.77,52.07 R5.2 24.77,53.02
N$3
  Bottom 0.406: D10.C C3.2 50.48,29.21 50.48,30.16 50.33,30.02 | R6.2 47.62,33.02 50.33,30.02 | 50.33,30.02 D7.A
N$4
  Bottom 0.406: R3.2 52.39,28.26 49.53,25.4 C3.1 48.58,22.54 D4.C
N$5
  Bottom 0.406: 24.77,61.6 20,61.6 R2.2 | 24.77,61.6 C2.1 | 24.77,61.6 28.57,63.5 36.2,63.5 D3.C
N$6
  Bottom 0.406: D12.C 39.05,22.54 C4.1 R7.2
N$7
  Bottom 0.406: 31.43,32.07 D16.A 29.53,27.31 32.38,24.45 36.2,24.45 C4.2 | 31.43,32.07 33.34,37.78 D18.C | 31.43,32.07 R10.2
N$8
  Bottom 0.406: Q1.3 60.96,63.5 65.72,71.12 R19.1
N$9
  Bottom 0.406: D46.A 62.87,70.17 60.01,75.88 D47.C
N$10
  Bottom 0.406: D43.C 95.25,81.6 85.72,81.6 | 81.92,81.6 85.72,81.6 | 81.92,81.6 79.06,82.55 73.34,82.55 71.44,80.65 71.44,79.69 69.53,77.79 67.63,77.79 62.87,79.69 D46.C | 85.72,81.6 R24.2 | 81.92,81.6 D53.C
N$11
  Bottom 0.406: D32.C 54.29,54.93 | 54.29,54.93 57.15,54.93 60.96,57.79 | 60.96,57.79 59.05,61.6 59.05,66.36 | 59.05,66.36 55.24,68.26 52.39,68.26 R25.1 | 54.29,54.93 Q5.2 | 59.05,66.36 D47.A | 60.96,57.79 Q1.1
N$12
  Bottom 0.406: D27.C 75.25,56.83 79.06,49.21 80.96,49.21 83.82,52.07 | 83.82,52.07 D28.A | C7.1 85.72,57.79 85.76,56.93 85.72,56.83 | 83.82,52.07 85.72,56.83 | R13.2 94.3,64.45 95.25,63.5 D26.C 95.25,58.74 93.34,56.83 85.72,56.83
N$13
  Bottom 0.813: D111.A 19.05,68.26 D112.C
N$14
  Bottom 0.406: Q1.2 63.82,60.64 63.82,63.5 65.72,65.41 68.58,63.5 77.15,63.5 79.06,60.64 83.82,60.64 D28.C 85.72,63.5 | 85.72,63.5 C7.2 87.63,67.31 R15.2 87.63,68.26 | 85.72,63.5 D36.C
N$15
  Bottom 0.406: 61.91,39.69 69.53,39.69 | 69.53,39.69 77.15,39.69 D131.C | 61.91,39.69 56.2,34.93 52.39,34.93 43.81,38.74 41.91,38.74 D117.C | 61.91,39.69 65.72,39.69 D125.C | 69.53,39.69 D102.C | 61.91,39.69 D93.A
N$16
  Bottom 0.813: D110.A 20.95,70.17 D111.C
N$17
  Bottom 0.406: 26.67,116.84 D8.C | 26.67,116.84 29.53,113.03 D5.A | 26.67,116.84 21.91,113.03 C1.2 | R4.2 27.62,116.84 26.67,116.84
N$18
  Bottom 0.406: D68.C 57.15,73.98 D67.A
N$19
  Bottom 0.406: 83.82,79.69 97.16,79.69 D70.C | 80.01,79.69 83.82,79.69 | 80.01,79.69 75.25,81.6 74.3,81.6 71.44,77.79 70.48,76.84 62.87,76.84 57.15,79.69 D67.C | 83.82,79.69 R35.2 | 80.01,79.69 D62.C
N$20
  Bottom 0.406: 80.32,62.17 D85.C | 80.32,62.17 81.92,63.5 C12.2 85.72,69.22 89.53,69.22 91.44,68.26 R44.2 91.44,67.31 93.34,62.55 D88.C 93.34,61.6 | Q8.2 77.15,65.41 80.01,62.55 80.32,62.17
N$21
  Bottom 0.406: Q7.2 49.53,53.02 | 49.53,53.02 53.34,56.83 53.34,65.41 | 53.34,65.41 50.48,65.41 R36.1 | 49.53,53.02 53.34,48.26 55.24,48.26 60.01,50.17 61.91,50.17 | D68.A 54.29,65.41 53.34,65.41 | 61.91,50.17 D93.C | 61.91,50.17 63.82,57.79 66.67,62.55 Q8.1
N$22
  Bottom 0.406: 21.91,107.32 C1.1 | 21.91,107.32 21.91,110.17 20,112.08 20,113.03 21.91,115.89 R1.2 | 21.91,107.32 24.77,106.36 D2.C
N$23
  Bottom 0.406: D42.A 66.67,96.84 66.67,100.65 | 66.67,100.65 68.58,105.41 68.58,113.03 66.67,116.84 52.39,116.84 | 52.39,116.84 44.77,116.84 40.01,118.75 37.15,118.75 29.53,122.56 D5.C | 66.67,100.65 D33.C | 52.39,116.84 D19.C
N$24
  Bottom 0.406: D98.C 48.58,104.46 | D98.C D94.A 48.58,111.13 46.67,114.94 R46.2 | C13.2 D98.C
N$26
  Bottom 0.406: U$1.BP2 110.49,19.69 109.54,20.64 105.73,20.64 103.82,18.73 103.82,7.3 100.97,4.45 57.15,4.45 54.29,7.3 D128.A D126.A
N$28
  Bottom 0.406: D14.C 50.48,102.55 | 50.48,102.55 54.29,102.55 R8.2 | 50.48,102.55 C5.1
N$29
  Bottom 0.406: D20.C 94.3,46.36 82.87,46.36 81.92,45.4 38.1,46.36 35.24,48.26 33.34,48.26 31.43,46.36 24.13,46.36 | 24.13,46.36 21.91,46.36 19.05,47.31 17.14,47.31 15.24,46.36 D31.A | 24.13,46.36 23.81,46.36 23.81,50.17 22.86,52.07 22.86,56.83 24.77,58.74 26.67,58.74 D6.C
N$30
  Bottom 0.406: 98.11,24.45 C6.1 | 98.11,24.45 D17.A | D13.C 93.34,23.5 98.11,23.5 | R9.2 94.3,28.26 98.11,24.45 | 98.11,23.5 98.11,24.45 | 98.11,23.5 D15.C
N$31
  Bottom 0.406: D23.C 98.11,30.16 | 98.11,33.02 R12.2 98.11,30.16 | 98.11,33.02 96.2,34.93 D20.A | 98.11,33.02 100.01,34.93 D17.C | 98.11,30.16 C6.2
N$32
  Bottom 0.406: 16.19,19.69 D30.C 10.48,20.64 8.57,23.5 8.57,28.26 10.48,30.16 13.34,32.07 | 13.34,32.07 20,39.69 D39.C | 13.34,32.07 R16.2
  Bottom 0.813: 16.19,19.69 D34.C
N$33
  Bottom 0.406: D55.C 22.86,16.83 D54.A
N$34
  Bottom 0.406: 86.68,24.45 C9.1 | D59.C 86.68,24.45 | 86.68,24.45 D63.C 88.58,22.54 92.39,26.35 | 92.39,26.35 R32.2 | 92.39,26.35 D66.A
N$35
  Bottom 0.406: D77.C 39.05,61.6 35.24,61.6 | 35.24,61.6 33.34,62.55 29.53,62.55 24.77,59.69 21.91,59.69 R40.2 | 35.24,61.6 C11.1
N$36
  Bottom 0.406: 29.53,53.02 C11.2 36.2,56.83 40.96,56.83 44.77,60.64 D87.C | 29.53,53.02 31.43,48.26 D83.A | 29.53,53.02 R43.2
N$37
  Bottom 0.406: 81.92,57.79 C12.1 83.82,59.69 91.44,59.69 | D85.A 81.92,57.79 | 81.92,57.79 D78.C | R41.2 89.53,64.45 91.44,59.69 | 91.44,58.74 D80.C 91.44,59.69
N$38
  Bottom 0.406: 80.96,29.21 C14.1 | D91.C 80.96,29.21 | R47.2 80.96,30.16 80.96,29.21
N$39
  Bottom 0.406: D101.C 82.87,28.26 82.87,32.07 | 82.87,33.02 R50.2 82.87,32.07 | 82.87,33.02 D99.A | 82.87,32.07 82.87,33.02 | 82.87,33.02 80.96,34.93 C14.2
N$40
  Bottom 0.406: D19.A 52.39,107.32 | 52.39,107.32 C5.2 R11.2 | 52.39,107.32 D21.C
N$41
  Bottom 0.406: D114.C 44.77,28.26 C17.1 43.81,32.07 R55.2
N$42
  Bottom 0.406: C17.2 42.86,33.97 40.01,32.07 | 40.01,32.07 41.91,29.21 D117.A | 40.01,32.07 38.1,38.74 D120.C | 40.01,32.07 R56.2
N$43
  Bottom 0.406: D10.A D1.A 46.35,6.03 48.58,3.49 102.87,3.49 105.73,6.35 105.73,18.73 106.68,19.69 108.58,19.69 111.44,16.83 U$1.BR2
N$44  (via drill 0.81)
  Top 0.406: v81.92,104.46 v83.82,111.13
  Bottom 0.406: 86.68,98.74 D40.C | D41.C 90.49,98.74 86.68,98.74 | 81.92,102.55 86.68,98.74 | 81.92,102.55 80.01,102.55 D44.C | 81.92,102.55 v81.92,104.46 | D49.C 84.77,114.94 82.87,113.98 | 82.87,113.98 R21.2 | v83.82,111.13 82.87,113.03 82.87,113.98
N$45
  Bottom 0.406: D96.C 63.82,27.31 | 63.82,33.02 R49.2 63.82,27.31 | 63.82,27.31 C15.1
N$46
  Bottom 0.406: D106.C 69.53,27.31 | R52.2 67.63,33.02 69.53,29.21 | 69.53,27.31 69.53,29.21 | 69.53,27.31 C15.2 | 69.53,29.21 D102.A
N$47
  Bottom 0.406: D65.C 81.92,94.93 D64.A
N$48
  Bottom 0.406: C10.1 57.15,107.32 D76.C R39.2 57.15,115.89
N$49
  Bottom 0.406: D129.C 71.44,26.35 73.34,30.16 | R64.2 71.44,32.07 73.34,30.16 | 73.34,30.16 C20.1
N$50
  Bottom 0.406: D132.C 75.25,28.26 77.15,29.21 | 77.15,29.21 75.25,32.07 R67.2 75.25,33.02 73.34,34.93 C20.2 | 77.15,29.21 D131.A
N$51
  Bottom 0.406: D89.C 40.96,99.7 C13.1 R45.2
N$53
  Bottom 0.406: D123.C 52.39,22.54 R60.2 54.29,30.16 59.05,34.93 60.96,34.93 C19.1
N$54
  Bottom 0.406: D126.C 61.91,30.16 | 61.91,30.16 R62.2 60.01,33.02 61.91,33.02 63.82,34.93 64.77,34.93 65.72,33.02 D125.A | 61.91,30.16 C19.2
N$55
  Bottom 0.406: D100.C 16.19,110.17 C16.1 R51.2 16.19,113.98
N$56
  Bottom 0.406: R53.2 18.1,110.17 20,109.22 | 20,109.22 D105.A | D108.C 20,104.46 | 20,104.46 20,109.22 | 20,104.46 C16.2
N$57
  Bottom 0.406: Q13.2 40.01,85.41 45.72,83.5 R74.1 45.72,82.55 42.86,80.65 C22.1
N$58  (via drill 0.81)
  Top 0.406: v107.63,87.31 103.82,87.31 100.97,84.46 65.72,84.46 57.15,81.6 52.39,84.46 39.05,84.46 38.1,85.41 38.1,90.17 v30.48,95.89
  Bottom 0.406: 20,93.98 18.1,93.03 D137.C | 20,93.98 22.86,93.98 | 22.86,93.98 26.67,93.98 28.57,94.93 | U$1.AR2 117.16,87.31 v107.63,87.31 | 28.57,94.93 v30.48,95.89 D116.A 30.48,97.79 | 22.86,93.98 R61.2 | 28.57,94.93 D109.A | D108.A 20,93.98
N$59
  Bottom 0.406: D44.A 74.3,100.65 D45.C
N$60
  Bottom 0.406: Q12.2 32.38,84.46 33.34,83.5 34.29,83.5 35.24,84.46 38.1,84.46 40.96,83.5 R70.1 40.96,82.55 38.1,80.65 C21.1
N$61
  Bottom 0.406: D71.A 67.63,97.79 67.63,99.7 70.48,105.41 70.48,111.13 68.58,116.84 66.67,118.75 59.05,118.75 | 48.58,121.6 44.77,119.7 38.1,119.7 29.53,124.46 27.62,124.46 26.67,121.6 21.91,121.6 20,119.7 D105.C | 48.58,121.6 59.05,118.75 | 48.58,121.6 D94.C | 59.05,118.75 D82.C
N$62  (via drill 0.81)
  Top 0.406: D69.C 90.49,101.6 90.49,109.22 v88.58,111.13
  Bottom 0.406: D69.C v93.34,96.84 85.72,96.84 82.87,98.74 D64.C | D58.C 88.58,114.94 86.68,113.98 R33.2 86.68,113.03 v88.58,111.13
N$63
  Bottom 0.406: D35.C 18.1,16.83 D34.A
N$64  (via drill 0.81)
  Top 0.406: v34.29,45.4 v31.43,55.88
  Bottom 0.406: D72.C 88.58,44.45 84.77,44.45 | 84.77,44.45 D99.C | 84.77,44.45 35.24,44.45 v34.29,45.4 18.1,45.4 D56.A | v31.43,55.88 D83.C
N$65
  Bottom 0.406: D54.C 18.1,21.59 12.38,21.59 9.53,24.45 9.53,27.31 11.43,29.21 17.14,32.07 | 17.14,32.07 24.77,39.69 D51.C | 17.14,32.07 R27.2
N$66
  Bottom 0.406: D86.C 60.01,98.74 | 60.01,98.74 62.87,100.65 62.87,102.55 59.05,109.22 | 59.05,109.22 D82.A | R42.2 59.05,113.03 59.05,109.22 | 60.01,98.74 C10.2
N$67
  Bottom 0.406: D73.C C9.2 R37.2 86.68,33.02 D72.A 88.58,34.93 D66.C
N$68
  Bottom 0.406: D45.A 69.53,98.74 D42.C 69.53,99.7 71.44,104.46 75.25,106.36 77.15,111.13 | 77.15,111.13 75.25,115.89 73.34,117.79 R22.1 | 77.15,111.13 Q4.2
N$69
  Bottom 0.406: D65.A 77.15,93.98 72.39,100.65 | 72.39,100.65 72.39,103.51 74.3,104.46 76.2,104.46 | 76.2,104.46 77.15,108.27 79.06,111.13 76.2,117.79 R34.1 | 76.2,104.46 Q6.2 | 72.39,100.65 D71.C
N$70  (via drill 0.81)
  Top 0.406: v13.34,24.45 13.34,26.35 15.24,28.26 15.24,33.02 17.14,34.93 17.14,37.78 15.24,39.69 15.24,42.55 16.19,43.5 17.14,46.36 17.14,51.12 v15.24,53.02
  Bottom 0.406: Q2.2 27.62,9.21 22.86,9.21 19.05,7.3 18.1,7.3 D35.A 18.1,11.11 22.86,20.64 21.91,22.54 v13.34,24.45 R17.1 | v15.24,53.02 D31.C
N$71  (via drill 0.81)
  Top 0.406: v18.1,26.35 23.81,32.07 23.81,38.74 20,42.55 20,49.21 16.19,53.98 17.14,56.83 v18.1,57.79
  Bottom 0.406: D55.A 23.81,7.3 29.53,7.3 30.48,8.26 30.48,9.21 28.57,11.11 Q3.2 28.57,21.59 25.72,25.4 v18.1,26.35 R28.1 | 18.1,54.93 D56.C v18.1,57.79
N$73
  Bottom 0.406: R59.2 32.38,113.98 D122.C | D122.C 32.38,113.03 29.53,110.17 28.57,110.17 25.72,113.03 | Q9.3 35.24,111.13 D122.C | 25.72,113.03 23.81,111.13 D8.A | 25.72,113.03 D11.A
N$74
  Bottom 0.406: Q8.3 66.67,68.26 69.53,69.22 R48.2
N$75
  Bottom 0.406: Q11.2 99.06,102.55 97.16,105.41 93.34,106.36 | 93.34,106.36 95.25,109.22 R72.1 | C24.1 93.34,106.36
N$77
  Bottom 0.406: Q10.2 100.97,116.84 | 100.97,116.84 R66.1 | 100.97,116.84 C23.1
N$80
  Bottom 0.406: C8.1 60.96,112.08 | 60.96,112.08 65.72,114.94 R14.2 | 60.96,112.08 D29.C
N$81  (via drill 0.81)
  Top 0.406: v66.67,107.32 v68.58,119.7
  Bottom 0.406: 63.82,98.74 D37.C 66.67,91.12 D33.A | 63.82,98.74 C8.2 | 63.82,98.74 63.82,101.6 66.67,104.46 v66.67,107.32 | v68.58,119.7 R18.2
N$82
  Bottom 0.406: 36.33,107.29 D118.C | 36.33,107.29 37.15,111.13 35.24,115.89 31.43,115.89 R57.2 | 36.33,107.29 36.2,107.32 D116.C
N$83
  Bottom 0.406: D118.A 36.2,96.84 D119.C
N$84
  Bottom 0.406: R58.1 38.1,113.98 Q9.2 39.05,108.27 40.96,106.36 40.96,104.46 39.05,100.65 D119.A
PC2MA  (via drill 0.81)
  Top 0.406: v107.63,93.98 101.92,93.98 95.25,86.36 69.53,86.36 65.72,90.17 v56.2,90.17
  Bottom 0.406: U$1.AM2 117.16,95.89 110.49,95.89 v107.63,93.98 | D29.A 57.15,100.65 D76.A 57.15,98.74 54.29,95.89 54.29,93.03 v56.2,90.17 D79.A
PC2MB  (via drill 0.81)
  Top 0.406: v108.58,6.35 104.14,1.91 45.72,1.91 v42.86,4.45
  Bottom 0.406: U$1.BV2 115.57,4.45 110.49,4.45 v108.58,6.35 | v42.86,4.45 D115.A 40.96,12.07 | 40.96,12.07 D12.A | 40.96,12.07 D114.A
PC=0  (via drill 0.81)
  Top 0.406: v107.63,82.55 105.73,80.65 105.73,69.22 107.63,67.31 107.63,60.64 108.58,59.69 v108.58,28.26 106.68,26.35 106.68,19.69 100.01,13.02 94.3,13.02 92.39,11.11 88.58,14.92 v84.77,14.92 84.77,20.64 82.87,22.54 82.87,23.5 84.77,25.4 84.77,33.02 80.01,37.78 72.39,37.78 69.53,33.97 53.34,33.97 50.48,36.83 43.81,36.83 40.01,29.21 v40.01,26.35 v36.2,20.64
  Bottom 0.406: U$1.BL2 117.16,29.21 110.49,29.21 v108.58,28.26 | 84.77,12.07 D121.A | Q2.3 35.24,14.92 | 35.24,14.92 v36.2,20.64 34.29,22.54 32.38,22.54 24.77,30.16 | 24.77,30.16 26.67,32.07 R23.2 | v107.63,82.55 103.82,82.55 102.87,83.5 63.82,83.5 60.01,85.41 D86.A | 84.77,13.02 D59.A 84.77,12.07 | v84.77,14.92 84.77,12.07 | 24.77,30.16 D51.A | 35.24,14.92 D50.C | v40.01,26.35 D120.A
PC=1  (via drill 0.81)
  Top 0.406: 97.16,21.59 92.39,16.83 v92.39,14.92 | 97.16,21.59 98.11,22.54 104.78,22.54 105.73,23.5 105.73,31.12 v106.68,32.07 107.63,33.02 107.63,58.74 106.68,59.69 106.68,66.36 104.78,68.26 v104.78,85.41 | v32.38,20.64 v32.38,26.35 32.38,29.21 36.2,39.69 39.05,44.45 82.87,44.45 84.77,42.55 92.39,33.02 94.3,26.35 94.3,24.45 97.16,21.59
  Bottom 0.406: U$1.BK2 117.16,33.02 109.54,33.02 v106.68,32.07 | 92.39,13.02 D24.A | v92.39,14.92 92.39,13.02 | 92.39,13.02 D13.A | 33.34,17.78 Q3.3 | 33.34,17.78 v32.38,20.64 25.72,27.31 22.86,27.31 20,29.21 D39.A 20,30.16 21.91,32.07 R20.2 21.91,33.02 | 33.34,17.78 D38.C | v32.38,26.35 D18.A | v104.78,85.41 103.82,84.46 88.58,84.46 86.68,85.41 63.82,85.41 D37.A
SET_MA
  Bottom 0.406: U$1.AK2 111.44,102.55 108.58,97.79 106.68,97.79 100.97,93.03 99.06,90.17 94.3,89.22 D69.A
SET_MB
  Bottom 0.406: U$1.AT2 111.44,80.65 94.3,73.03 94.3,70.17 95.25,69.22 98.11,69.22 | 98.11,69.22 100.97,71.12 R38.2 | 98.11,69.22 100.97,67.31 D74.C | D70.A 98.11,69.22
SHIFT  (via drill 0.81)
  Top 0.406: v108.58,10.16 101.92,3.49 53.34,3.49 v50.48,6.35
  Bottom 0.406: U$1.BU2 116.52,7.3 111.44,7.3 v108.58,10.16 | 50.48,11.11 D124.A v50.48,6.35 | 50.48,11.11 D4.A | 50.48,11.11 D123.A
SR
  Bottom 0.406: U$1.BF2 116.2,42.55 110.49,42.55 107.63,44.45 104.78,44.45 103.82,43.5 103.82,22.54 101.92,20.64 101.92,9.21 100.01,7.3 83.82,7.3 79.06,11.11 | 79.06,11.11 D104.A | D101.A 79.06,11.11
SR2PC  (via drill 0.81)
  Top 0.406: v105.73,54.93 103.82,53.02 96.2,53.02 93.34,49.21 93.34,46.36 92.39,44.45 92.39,42.55 v96.2,38.74 | v77.15,35.88 77.15,32.07 75.25,30.16 75.25,27.31 73.34,24.45 77.15,19.69 v77.15,16.83
  Bottom 0.406: U$1.BB2 117.16,54.93 v105.73,54.93 | v96.2,38.74 82.87,38.74 v77.15,35.88 | v77.15,16.83 75.25,15.88 74.92,15.05 | 74.92,15.05 73.34,11.11 D92.A | 74.92,15.05 75.25,14.92 D91.A

## Text on the board
Bottom: MA MB PC R211J | 12-65